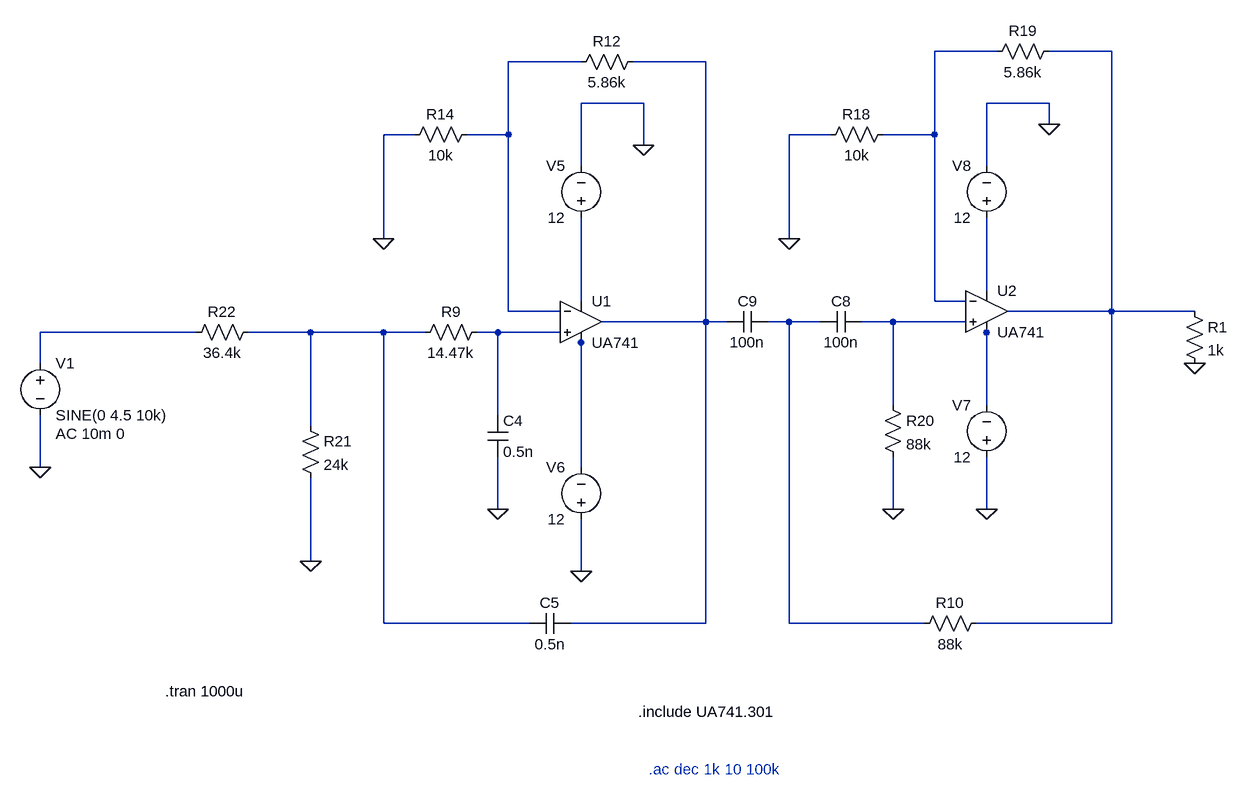
[diagram p0: schematic Filter_stage.asc]
Filter_stage.asc, the LTspice schematic file:
Version 4.1
SHEET 1 5036 884
WIRE 2240 -320 2144 -320
WIRE 2416 -320 2320 -320
WIRE 1600 -304 1488 -304
WIRE 1792 -304 1680 -304
WIRE 1696 -240 1600 -240
WIRE 2320 -240 2224 -240
WIRE 2320 -208 2320 -240
WIRE 1344 -192 1296 -192
WIRE 1488 -192 1488 -304
WIRE 1488 -192 1424 -192
WIRE 1984 -192 1920 -192
WIRE 2144 -192 2144 -320
WIRE 2144 -192 2064 -192
WIRE 1696 -176 1696 -240
WIRE 1600 -144 1600 -240
WIRE 2224 -144 2224 -240
WIRE 1296 -32 1296 -192
WIRE 1920 -32 1920 -192
WIRE 2224 48 2224 -64
WIRE 1600 64 1600 -64
WIRE 2144 64 2144 -192
WIRE 2192 64 2144 64
WIRE 1488 80 1488 -192
WIRE 1568 80 1488 80
WIRE 2416 80 2416 -320
WIRE 2416 80 2256 80
WIRE 2544 80 2416 80
WIRE 1792 96 1792 -304
WIRE 1792 96 1632 96
WIRE 1824 96 1792 96
WIRE 1920 96 1888 96
WIRE 1968 96 1920 96
WIRE 2080 96 2032 96
WIRE 2192 96 2080 96
WIRE 1008 112 768 112
WIRE 1184 112 1088 112
WIRE 1296 112 1184 112
WIRE 1360 112 1296 112
WIRE 1472 112 1440 112
WIRE 1568 112 1472 112
WIRE 2224 112 2224 96
WIRE 1600 128 1600 112
WIRE 768 160 768 112
WIRE 2080 224 2080 96
WIRE 2224 224 2224 112
WIRE 1472 240 1472 112
WIRE 1184 256 1184 112
WIRE 768 320 768 240
WIRE 1600 320 1600 128
WIRE 1472 384 1472 304
WIRE 2080 384 2080 304
WIRE 2224 384 2224 304
WIRE 1184 464 1184 336
WIRE 1600 480 1600 400
WIRE 1296 560 1296 112
WIRE 1520 560 1296 560
WIRE 1792 560 1792 96
WIRE 1792 560 1584 560
WIRE 1920 560 1920 96
WIRE 2128 560 1920 560
WIRE 2416 560 2416 80
WIRE 2416 560 2208 560
FLAG 768 320 0
FLAG 1600 480 0
FLAG 2224 384 0
FLAG 2320 -208 0
FLAG 1696 -176 0
FLAG 1472 384 0
FLAG 1296 -32 0
FLAG 1920 -32 0
FLAG 2080 384 0
FLAG 1184 464 0
FLAG 2544 160 0
SYMBOL voltage 768 144 R0
WINDOW 123 24 124 Left 2
WINDOW 39 0 0 Left 0
SYMATTR Value2 AC 10m 0
SYMATTR InstName V1
SYMATTR Value SINE(0 4.5 10k)
SYMBOL OpAmps\\opamp2 1600 32 R0
SYMATTR InstName U1
SYMATTR Value UA741
SYMBOL voltage 1600 -48 R180
WINDOW 0 24 96 Left 2
WINDOW 3 24 16 Left 2
SYMATTR InstName V5
SYMATTR Value 12
SYMBOL voltage 1600 416 R180
WINDOW 0 24 96 Left 2
WINDOW 3 24 16 Left 2
SYMATTR InstName V6
SYMATTR Value 12
SYMBOL OpAmps\\opamp2 2224 16 R0
SYMATTR InstName U2
SYMATTR Value UA741
SYMBOL voltage 2224 320 R180
WINDOW 0 24 96 Left 2
WINDOW 3 24 16 Left 2
SYMATTR InstName V7
SYMATTR Value 12
SYMBOL voltage 2224 -48 R180
WINDOW 0 24 96 Left 2
WINDOW 3 24 16 Left 2
SYMATTR InstName V8
SYMATTR Value 12
SYMBOL res 1456 96 R90
WINDOW 0 0 56 VBottom 2
WINDOW 3 32 56 VTop 2
SYMATTR InstName R9
SYMATTR Value 14.47k
SYMBOL cap 1456 240 R0
SYMATTR InstName C4
SYMATTR Value 0.5n
SYMBOL cap 1584 544 R90
WINDOW 0 0 32 VBottom 2
WINDOW 3 32 32 VTop 2
SYMATTR InstName C5
SYMATTR Value 0.5n
SYMBOL cap 2032 80 R90
WINDOW 0 0 32 VBottom 2
WINDOW 3 32 32 VTop 2
SYMATTR InstName C8
SYMATTR Value 100n
SYMBOL cap 1888 80 R90
WINDOW 0 0 32 VBottom 2
WINDOW 3 32 32 VTop 2
SYMATTR InstName C9
SYMATTR Value 100n
SYMBOL res 2224 544 R90
WINDOW 0 0 56 VBottom 2
WINDOW 3 32 56 VTop 2
SYMATTR InstName R10
SYMATTR Value 88k
SYMBOL res 1696 -320 R90
WINDOW 0 0 56 VBottom 2
WINDOW 3 32 56 VTop 2
SYMATTR InstName R12
SYMATTR Value 5.86k
SYMBOL res 1440 -208 R90
WINDOW 0 0 56 VBottom 2
WINDOW 3 32 56 VTop 2
SYMATTR InstName R14
SYMATTR Value 10k
SYMBOL res 2080 -208 R90
WINDOW 0 0 56 VBottom 2
WINDOW 3 32 56 VTop 2
SYMATTR InstName R18
SYMATTR Value 10k
SYMBOL res 2336 -336 R90
WINDOW 0 0 56 VBottom 2
WINDOW 3 32 56 VTop 2
SYMATTR InstName R19
SYMATTR Value 5.86k
SYMBOL res 2064 208 R0
SYMATTR InstName R20
SYMATTR Value 88k
SYMBOL res 1168 240 R0
SYMATTR InstName R21
SYMATTR Value 24k
SYMBOL res 1104 96 R90
WINDOW 0 0 56 VBottom 2
WINDOW 3 32 56 VTop 2
SYMATTR InstName R22
SYMATTR Value 36.4k
SYMBOL res 2528 64 R0
SYMATTR InstName R1
SYMATTR Value 1k
TEXT 960 664 Left 2 !.tran 1000u
TEXT 1688 696 Left 2 !.include UA741.301
TEXT 1704 784 Left 2 ;.ac dec 1k 10 100k

The netlist it stands for:
* Filter_stage.asc
V1 N009 0 SINE(0 4.5 10k) AC 10m 0
X§U1 N011 N003 N006 N013 N004 UA741  ; pins In+ In- V+ V- OUT
V5 N006 0 12
V6 0 N013 12
X§U2 N008 N001 N005 N012 N002 UA741  ; pins In+ In- V+ V- OUT
V7 0 N012 12
V8 N005 0 12
R9 N011 N010 14.47k
C4 N011 0 0.5n
C5 N004 N010 0.5n
C8 N008 N007 100n
C9 N007 N004 100n
R10 N002 N007 88k
R12 N004 N003 5.86k
R14 N003 0 10k
R18 N001 0 10k
R19 N002 N001 5.86k
R20 N008 0 88k
R21 N010 0 24k
R22 N010 N009 36.4k
R1 N002 0 1k
.tran 1000u
.include UA741.301
* .ac dec 1k 10 100k
.backanno
.end